# EAGLE design Motor (EAGLE 9.2.0)
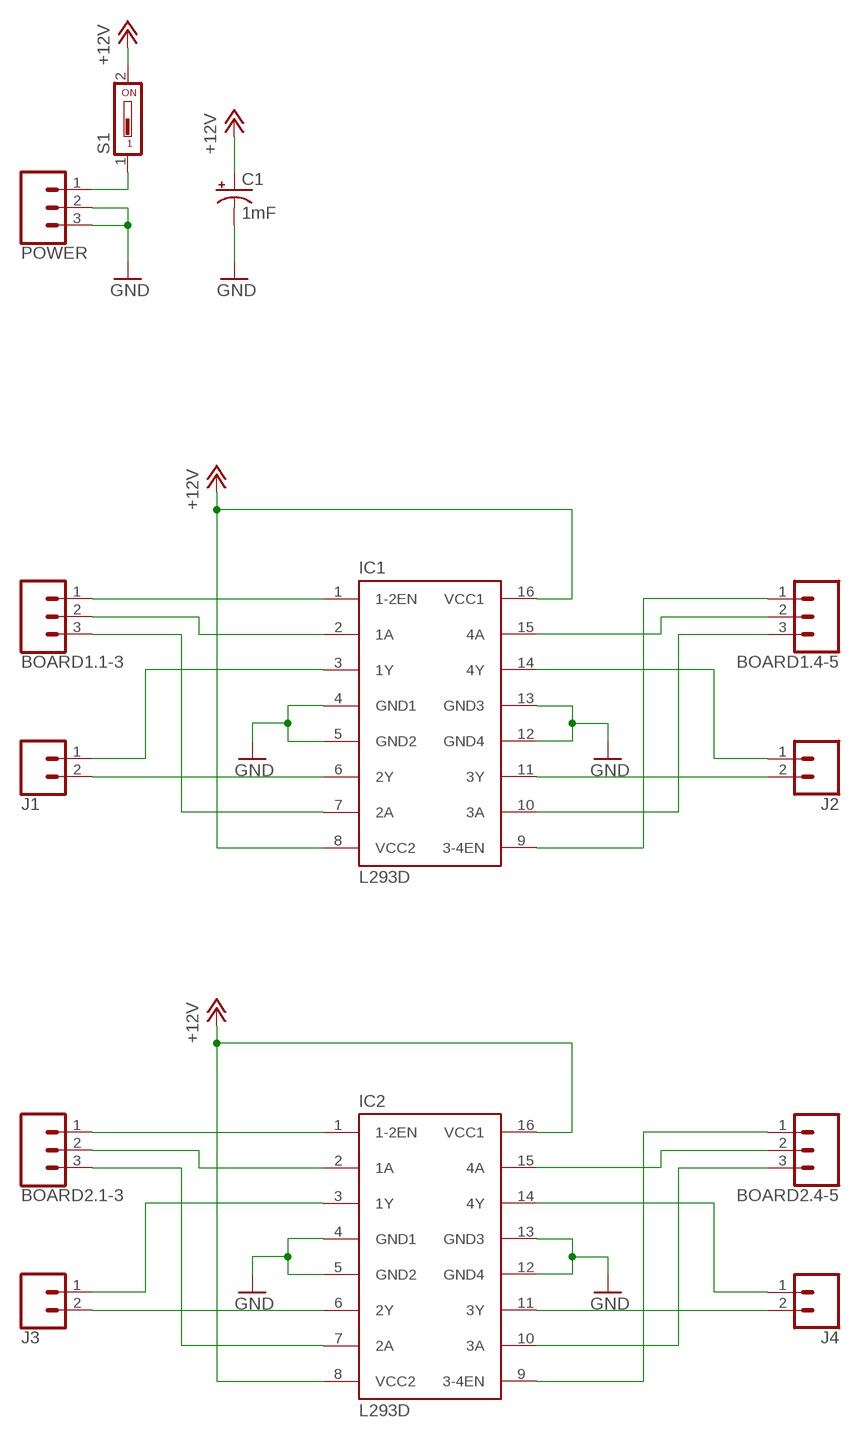
[diagram p0: schematic, sheet 1]

## Parts
BOARD1.1-3  CONN_03  [1X03]
BOARD1.4-5  CONN_03  [1X03]
BOARD2.1-3  CONN_03  [1X03]
BOARD2.4-5  CONN_03  [1X03]
C1  1mF  1000UF-RADIAL-5MM-25V-20%  [CPOL-RADIAL-5MM-10MM]
IC1  L293D  [DIL16]
IC2  L293D  [DIL16]
J1  CONN_02  [1X02]
J2  CONN_02  [1X02]
J3  CONN_02  [1X02]
J4  CONN_02  [1X02]
POWER  CONN_03  [1X03]
S1  DS01  [DS-01]

## Nets
+9V [supply]: C1.+ IC1.8(VCC2) IC1.16(VCC1) IC2.8(VCC2) IC2.16(VCC1) S1.2 ; supply symbol labelled +12V
EN1: BOARD1.1-3.1 IC1.1(1-2EN)
EN2: BOARD2.1-3.1 IC2.1(1-2EN)
GND: C1.- IC1.4(GND1) IC1.5(GND2) IC1.12(GND4) IC1.13(GND3) IC2.4(GND1) IC2.5(GND2) IC2.12(GND4) IC2.13(GND3) POWER.2 POWER.3
N$1: IC1.3(1Y) J1.1
N$2: IC1.6(2Y) J1.2
N$3: IC1.14(4Y) J2.1
N$4: IC1.11(3Y) J2.2
N$5: BOARD1.1-3.2 IC1.2(1A)
N$6: BOARD1.1-3.3 IC1.7(2A)
N$7: BOARD1.4-5.3 IC1.10(3A)
N$8: BOARD1.4-5.2 IC1.15(4A)
N$9: IC2.3(1Y) J3.1
N$10: IC2.6(2Y) J3.2
N$11: IC2.14(4Y) J4.1
N$12: IC2.11(3Y) J4.2
N$13: BOARD2.1-3.2 IC2.2(1A)
N$14: BOARD2.1-3.3 IC2.7(2A)
N$15: BOARD2.4-5.1 IC2.9(3-4EN)
N$16: BOARD1.4-5.1 IC1.9(3-4EN)
N$17: BOARD2.4-5.3 IC2.10(3A)
N$18: BOARD2.4-5.2 IC2.15(4A)
N$19: POWER.1 S1.1

## Library data of the parts
BOARD1.1-3 BOARD1.4-5 BOARD2.1-3 BOARD2.4-5 POWER = SparkFun-Connectors:CONN_03: Multi connection point. Often used as Generic Header-pin footprint for 0.1 inch spaced/style header connections On any of the 0.1 inch spaced packages, you can populate with these: Break Away Headers - Straight <https://www.sparkfun.com/products/116> (PRT-00116) Break Away Male Headers - Right Angle <https://www.sparkfun.com/products/553> (PRT-00553) Female Headers <https://www.sparkfun.com/products/115> (PRT-00115) Break Away Headers - Machine Pin <https://www.sparkfun.com/products/117> (PRT-00117) Break Away Female Headers - Swiss Machine Pin <https://www.sparkfun.com/products/743> (PRT-00743) Stackable Header - 3 Pin (Female, 0.1") <https://www.sparkfun.com/products/13875> (PRT-13875) For SCREWTERMINALS and SPRING TERMINALS visit here: Screw Terimnals on SparkFun.com <https://www.sparkfun.com/search/results?term=Screw+Terminals> (5mm/3.5mm/2.54mm spacing) This device is also useful as a general connection point to wire up your design to another part of your project. Our various solder wires solder well into these plated through hole pads. Hook-Up Wire - Assortment (Stranded, 22 AWG) <https://www.sparkfun.com/products/11375> (PRT-11375) Hook-Up Wire - Assortment (Solid Core, 22 AWG) <https://www.sparkfun.com/products/11367> (PRT-11367) View the entire wire category on our website here <https://www.sparkfun.com/categories/141> Special notes: Molex polarized connector foot print use with SKU : PRT-08232 with associated crimp pins and housings.
C1 = SparkFun-Capacitors:1000UF: 1,000µF/1mF ceramic capacitors A capacitor is a passive two-terminal electrical component used to store electrical energy temporarily in an electric field. CAP-08070; PROD_ID: CAP-09538
IC1 IC2 = st-microelectronics:L293D: PUSH-PULL 4 CHANNEL DRIVER; MPN: L293D; OC_FARNELL: 9589619; OC_NEWARK: 56P8249
J1-J4 = SparkFun-Connectors:CONN_02: Multi connection point. Often used as Generic Header-pin footprint for 0.1 inch spaced/style header connections On any of the 0.1 inch spaced packages, you can populate with these: Break Away Headers - Straight <https://www.sparkfun.com/products/116> (PRT-00116) Break Away Male Headers - Right Angle <https://www.sparkfun.com/products/553> (PRT-00553) Female Headers <https://www.sparkfun.com/products/115> (PRT-00115) Break Away Headers - Machine Pin <https://www.sparkfun.com/products/117> (PRT-00117) Break Away Female Headers - Swiss Machine Pin <https://www.sparkfun.com/products/743> (PRT-00743) For SCREWTERMINALS and SPRING TERMINALS visit here: Screw Terimnals on SparkFun.com <https://www.sparkfun.com/search/results?term=Screw+Terminals> (5mm/3.5mm/2.54mm spacing) This device is also useful as a general connection point to wire up your design to another part of your project. Our various solder wires solder well into these plated through hole pads. Hook-Up Wire - Assortment (Stranded, 22 AWG) <https://www.sparkfun.com/products/11375> (PRT-11375) Hook-Up Wire - Assortment (Solid Core, 22 AWG) <https://www.sparkfun.com/products/11367> (PRT-11367) View the entire wire category on our website here <https://www.sparkfun.com/categories/141> Special notes: Molex polarized connector foot print use with: PRT-08233 with associated crimp pins and housings. 2.54_SCREWTERM for use with PRT-10571. 3.5mm Screw Terminal footprints for PRT-08084 5mm Screw Terminal footprints for use with PRT-08432
S1 = switch-dil:DS01: DIL/CODE SWITCH; OC_FARNELL: unknown; OC_NEWARK: unknown

## Net classes
1 supply: width 1.016 mm

## Board
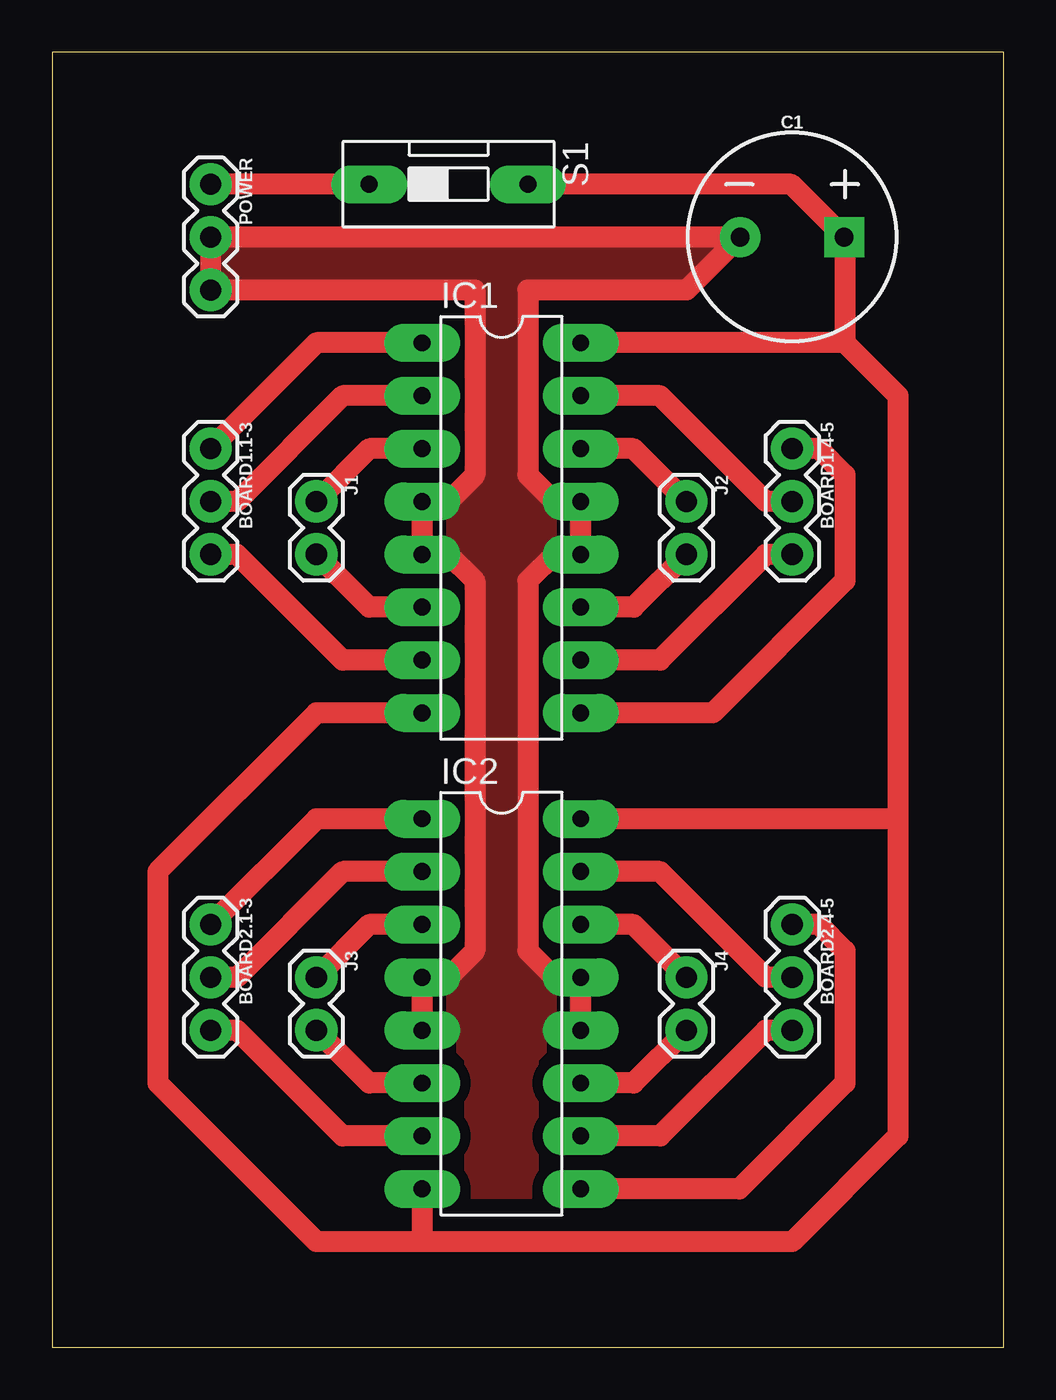
[diagram p1: board, top side]

Size 45.72 x 62.23 mm. Coordinates in mm from the lower left corner, seen from the top.
Outline: 0,0 45.72,0 45.72,62.23 0,62.23 0,0
Copper layers (1*16): Top 0.035mm / dielectric 1.5mm / Bottom 0.035mm
Design rules "Webb_PCB *": minimum track width 20mil, minimum drill 20mil, track to track 20mil, track to pad 20mil, pad to pad 20mil, via to via 20mil, smd to smd 10mil, copper to edge 100mil, drill to drill 20mil, minimum pad ring 20mil, minimum via ring 8mil, stop-mask expansion 4mil, vias tented up to drill 0mil, thermal gap 0mil

### Footprints (pad centres in the part's own frame; a part is rotated, then mirrored left to right if it is on the bottom)
1X03 = drill 1.016 pad 1.88: 1 0,0; 2 2.54,0; 3 5.08,0
CPOL-RADIAL-5MM-10MM = drill 0.9 pad 1.93 square: + 2.5,0 | drill 0.9 pad 1.93: - -2.5,0
DIL16 = drill 0.813 long: 1 -8.89,-3.81; 2 -6.35,-3.81; 3 -3.81,-3.81; 4 -1.27,-3.81; 5 1.27,-3.81; 6 3.81,-3.81; 7 6.35,-3.81; 8 8.89,-3.81; 9 8.89,3.81; 10 6.35,3.81; 11 3.81,3.81; 12 1.27,3.81; 13 -1.27,3.81; 14 -3.81,3.81; 15 -6.35,3.81; 16 -8.89,3.81
1X02 = drill 1.016 pad 1.88: 1 0,0; 2 2.54,0
DS-01 = drill 0.813 long: 1 0,-3.81; 2 0,3.81

### Placement (x,y rotation side)
BOARD1.1-3  7.62,43.18 270 top
BOARD1.4-5  35.56,43.18 270 top
BOARD2.1-3  7.62,20.32 270 top
BOARD2.4-5  35.56,20.32 270 top
C1  35.56,53.34 0 top
IC1  21.59,39.37 270 top
IC2  21.59,16.51 270 top
J1  12.7,40.64 270 top
J2  30.48,40.64 270 top
J3  12.7,17.78 270 top
J4  30.48,17.78 270 top
POWER  7.62,55.88 270 top
S1  19.05,55.88 270 top

### Tracks (layer width: path | path; a pad name or v marks a point on that pad's centre or on a via)
+9V
  Top 1.016: 38.1,48.26 IC1.16 | 38.1,48.26 38.06,48.3 | IC2.8 17.78,5.08 | 17.78,5.08 35.56,5.08 40.64,10.16 40.64,25.4 | 40.64,25.4 IC2.16 | 17.78,5.08 12.7,5.08 5.08,12.7 5.08,22.86 12.7,30.48 IC1.8 | S1.2 35.52,55.88 C1.+ 38.1,53.3 38.1,48.26 | 38.1,48.26 40.64,45.72 40.64,25.4
EN1
  Top 1.016: BOARD1.1-3.1 12.7,48.26 IC1.1
EN2
  Top 1.016: BOARD2.1-3.1 12.7,25.4 IC2.1
GND
  Top 1.016: IC2.12 IC2.13 24.13,17.78 22.86,19.05 22.86,36.83 24.13,38.1 IC1.12 IC1.13 24.13,40.64 22.86,41.91 22.86,50.8 30.48,50.8 33.02,53.34 | IC2.5 IC2.4 19.05,17.78 20.32,19.05 20.32,36.83 19.05,38.1 IC1.5 IC1.4 19.05,40.64 20.32,41.91 20.32,50.8 POWER.3 POWER.2 33.02,53.34 | C1.- 33.02,53.34
  pour Top: 17.78,40.64 19.05,40.64 20.32,41.91 20.32,50.8 7.62,50.8 7.62,53.34 33.02,53.34 30.48,50.8 22.86,50.8 22.86,41.91 24.13,40.64 25.4,40.64 25.4,38.1 24.13,38.1 22.86,36.83 22.86,19.05 24.13,17.78 25.4,17.78 25.4,15.24 24.13,15.24 22.86,13.97 22.86,7.62 20.32,7.62 20.32,13.97 19.05,15.24 17.78,15.24 17.78,17.78 19.05,17.78 20.32,19.05 20.32,36.83 19.05,38.1 17.78,38.1
N$1
  Top 1.016: J1.1 15.24,43.18 IC1.3
N$2
  Top 1.016: J1.2 15.24,35.56 IC1.6
N$3
  Top 1.016: IC1.14 27.94,43.18 J2.1
N$4
  Top 1.016: IC1.11 27.94,35.56 J2.2
N$5
  Top 1.016: IC1.2 13.97,45.72 8.89,40.64 BOARD1.1-3.2
N$6
  Top 1.016: BOARD1.1-3.3 8.89,38.1 13.97,33.02 IC1.7
N$7
  Top 1.016: BOARD1.4-5.3 34.29,38.1 29.21,33.02 IC1.10
N$8
  Top 1.016: BOARD1.4-5.2 34.29,40.64 29.21,45.72 IC1.15
N$9
  Top 1.016: IC2.3 15.24,20.32 J3.1
N$10
  Top 1.016: IC2.6 15.24,12.7 J3.2
N$11
  Top 1.016: IC2.14 27.94,20.32 J4.1
N$12
  Top 1.016: IC2.11 27.94,12.7 J4.2
N$13
  Top 1.016: BOARD2.1-3.2 8.89,17.78 13.97,22.86 IC2.2
N$14
  Top 1.016: IC2.7 13.97,10.16 8.89,15.24 BOARD2.1-3.3
N$15
  Top 1.016: BOARD2.4-5.1 36.83,20.32 38.1,19.05 38.1,12.7 33.02,7.62 IC2.9
N$16
  Top 1.016: BOARD1.4-5.1 36.83,43.18 38.1,41.91 38.1,36.83 31.75,30.48 IC1.9
N$17
  Top 1.016: BOARD2.4-5.3 34.29,15.24 29.21,10.16 IC2.10
N$18
  Top 1.016: BOARD2.4-5.2 34.29,17.78 29.21,22.86 IC2.15
N$19
  Top 1.016: S1.1 POWER.1